# Altium schematic sheet HMC830_PLL.SchDoc: Sayma RTM
size 420 x 297 mm; $$Internal___BlkDate: 23:43:20_12-13-18; $$Internal_NAME_PLACEHOLDER: a2sheet_WUT; $$Internal_Resolution: 00001mm; $$NotCommonProperty_@NAME: Clock_Distribution_PLL; $$NotCommonProperty_@SHEET: 1; $$NotCommonProperty_@SHEETTOTAL: 16; CmpIndex: 103; Drawing Author: G.Kasprowicz; Drawing Number: Sayma RTM; Drawing Project: 8 channel SAWG; Drawing Revision: 2.0; SymIndex: 2228; Author: G.Kasprowicz; CompanyName: WUT ISE; DrawnBy: G.Kasprowicz; Organization: WUT ISE; Address1: PW ISE; Address2: Nowowiejska 15/19 00-665 Warsaw; Address3: gkasprow@gmail.com; DocumentNumber: 10; Revision: 1.0; SheetNumber: 10; SheetTotal: 15; ModifiedBy: -; CheckedDate: -; Title2: HMC830 & CLK distribution; DivGrp: WUT ISE; Designer: G.Kasprowicz; ModifiedDate: -; ProjectName: Sensor Box
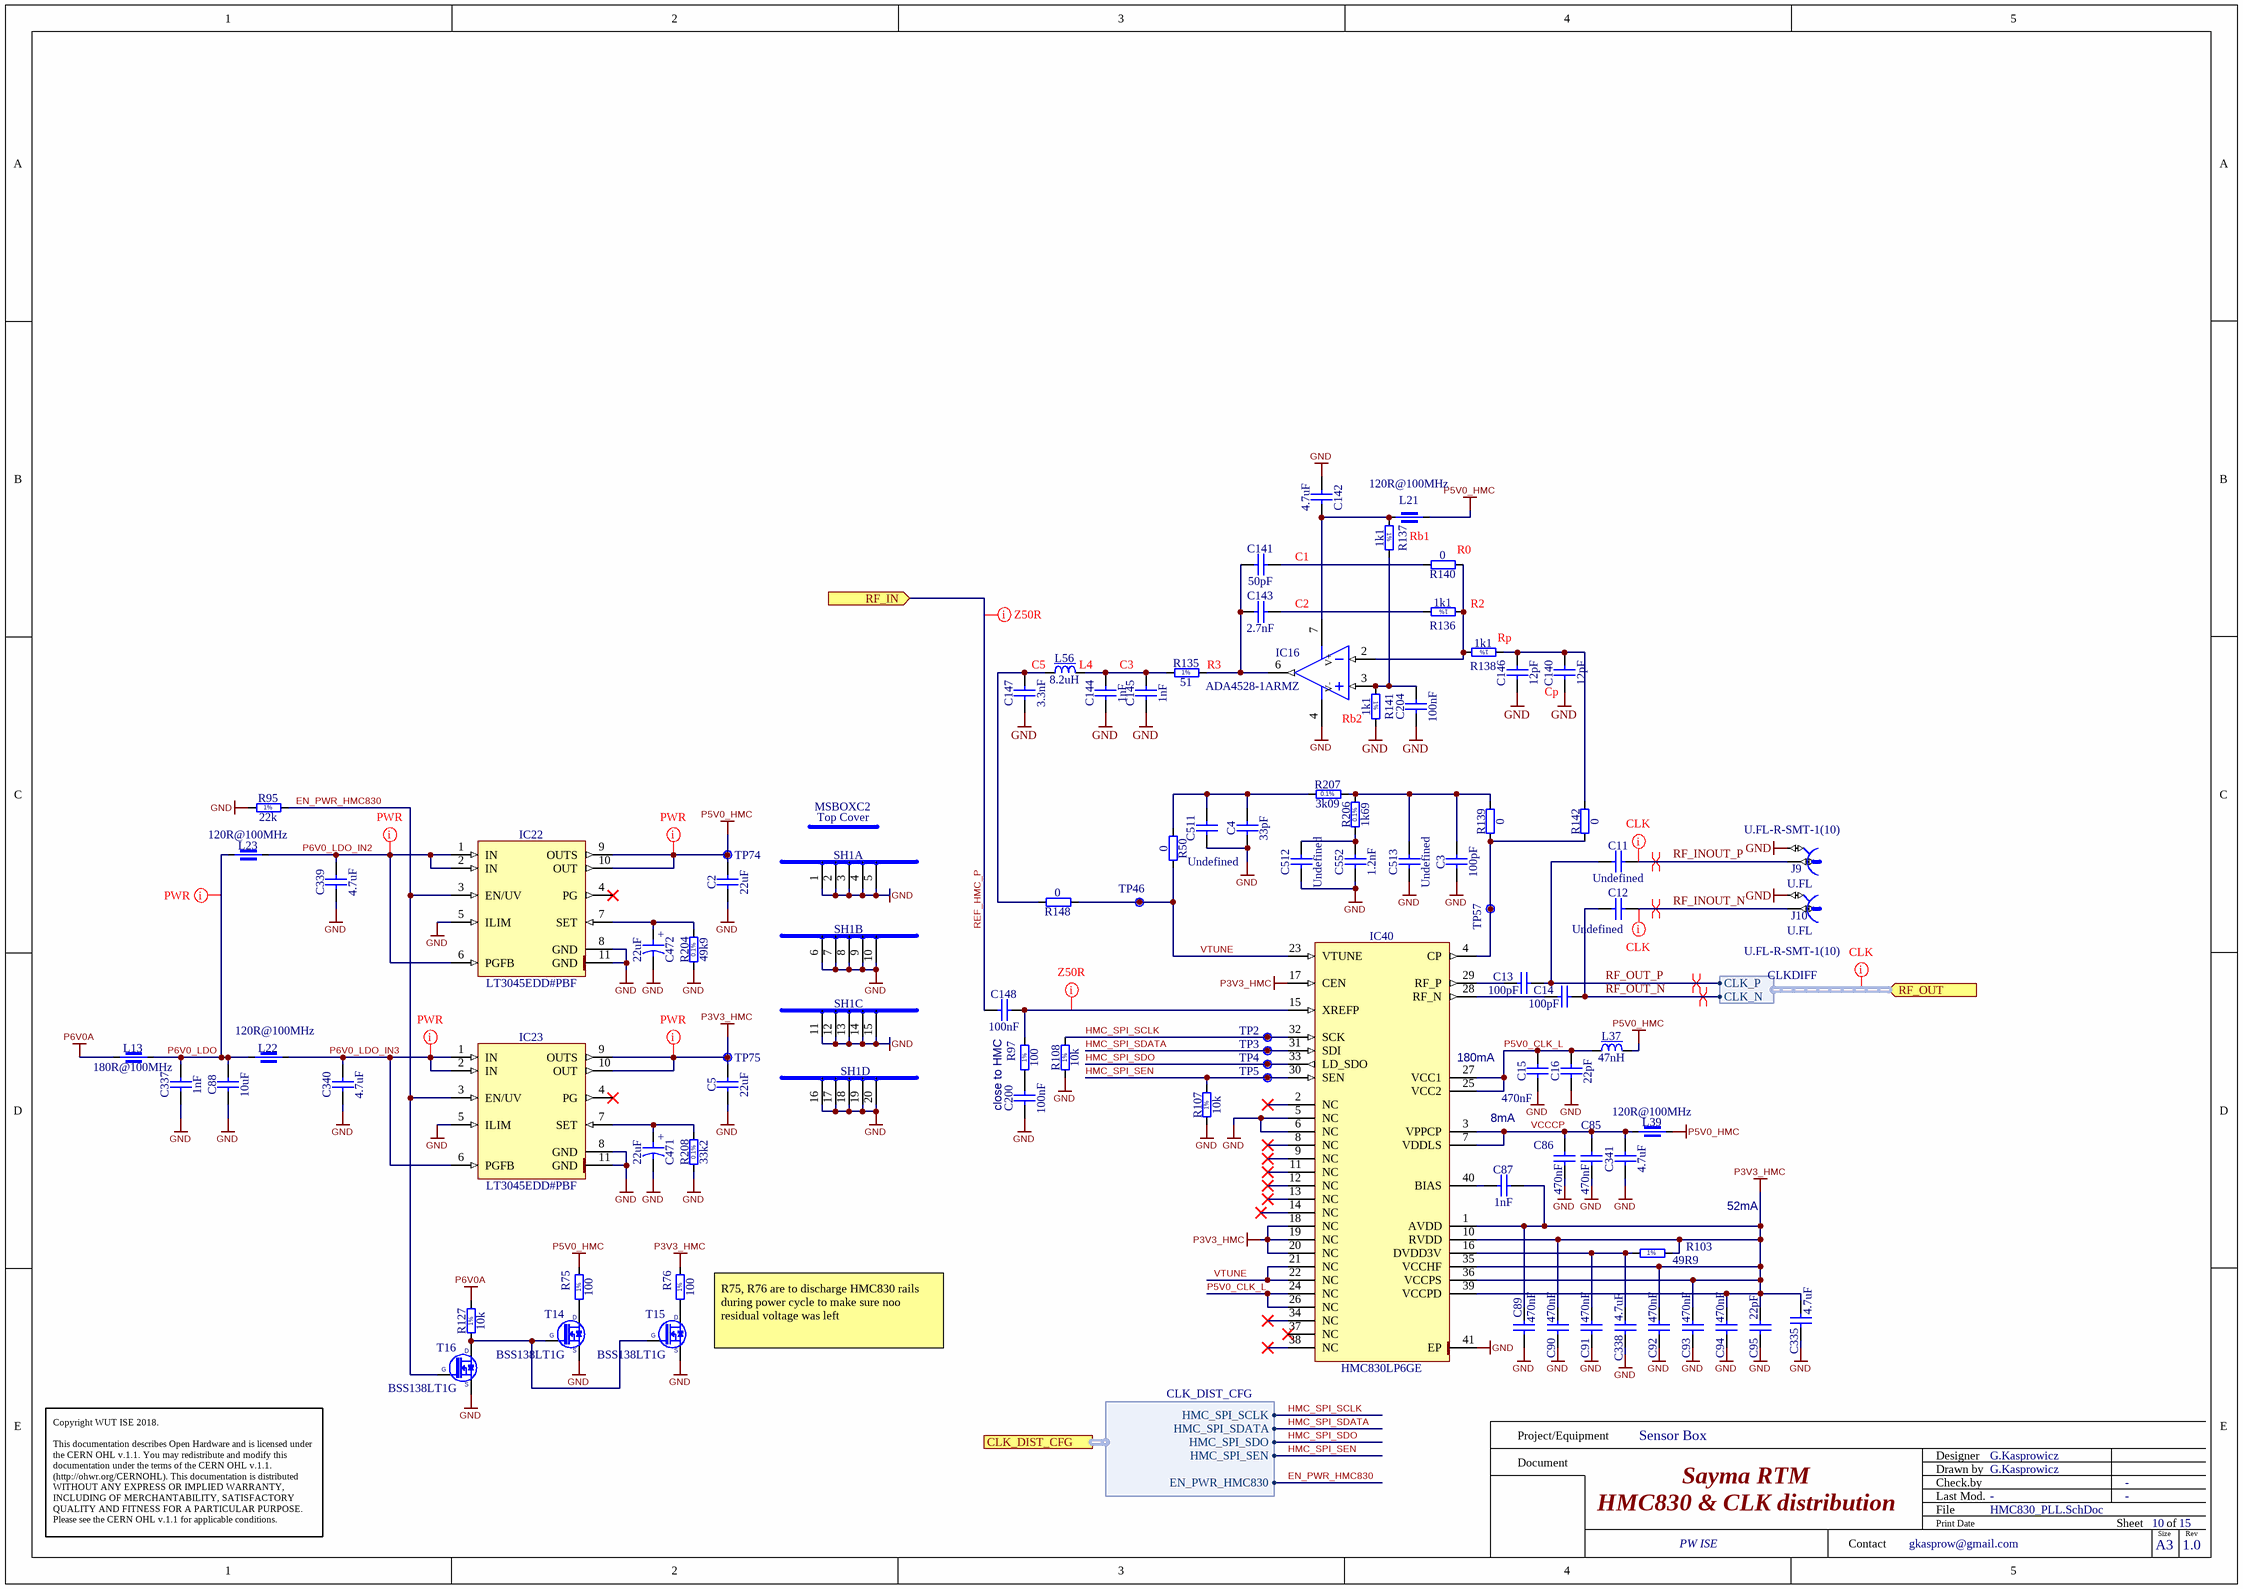
[diagram p0: HMC830_PLL.SchDoc]

## Parts
C2  22uF  [CAPC2012X135N]
C3  100pF  [CAPC1608X87N]
C4  33pF  [CAPC1608X87N]
C5  22uF  [CAPC2012X135N]
C11  Undefined  [CAPC1005X55N]
C12  Undefined  [CAPC1005X55N]
C13  100pF  [CAPC1608X87N]
C14  100pF  [CAPC1608X87N]
C15  470nF  [CAPC1005X55N]
C16  22pF  [CAPC1005X55N]
C85  470nF  [CAPC1005X55N]
C86  470nF  [CAPC1005X55N]
C87  1nF  [CAPC1005X55N]
C88  10uF  [CAPC3216X180N]
C89  470nF  [CAPC1005X55N]
C90  470nF  [CAPC1005X55N]
C91  470nF  [CAPC1005X55N]
C92  470nF  [CAPC1005X55N]
C93  470nF  [CAPC1005X55N]
C94  470nF  [CAPC1005X55N]
C95  22pF  [CAPC1005X55N]
C140  12pF  [CAPC1608X87N]
C141  50pF  [CAPC1608X90N]
C142  4.7uF  [CAPC1608X90N]
C143  2.7nF  [CAPC3216X140N]
C144  1nF  [CAPC1608X90N]
C145  1nF  [CAPC1608X90N]
C146  12pF  [CAPC1608X87N]
C147  3.3nF  [CAPC1608X87N]
C148  100nF  [CAPC0603X33N]
C200  100nF  [CAPC0603X33N]
C204  100nF  [CAPC0603X33N]
C335  4.7uF  [CAPC1608X90N]
C337  1nF  [CAPC1608X90N]
C338  4.7uF  [CAPC1608X90N]
C339  4.7uF  [CAPC1608X90N]
C340  4.7uF  [CAPC1608X90N]
C341  4.7uF  [CAPC1608X90N]
C471  22uF  [CAPMP3216X180N]
C472  22uF  [CAPMP3216X180N]
C511  Undefined  [CAPC2012X135N]
C512  Undefined  [CAPC2012X135N]
C513  Undefined  [CAPC2012X135N]
C552  1.2nF  [CAPC3216X140N]
IC16  ADA4528-1ARMZ  [SOP65P490X110-8N]
IC22  LT3045EDD#PBF  [SON50P300X300X80-11N-R175X248]
IC23  LT3045EDD#PBF  [SON50P300X300X80-11N-R175X248]
IC40  HMC830LP6GE  [QFN50P600X600X90-41N-S475]
J9  Manufacturer Part Number: U.FL-R-SMT-1(10)  [HIROSE_U.FL-R-SMT-1(10)]  (hidden comment: U.FL)
J10  Manufacturer Part Number: U.FL-R-SMT-1(10)  [HIROSE_U.FL-R-SMT-1(10)]  (hidden comment: U.FL)
L13  180R@100MHz  [INDC4516X180N]
L21  120R@100MHz  [INDC1608X95N]
L22  120R@100MHz  [INDC1608X95N]
L23  120R@100MHz  [INDC1608X95N]
L37  47nH  [INDC2014X145N]
L39  120R@100MHz  [INDC1608X95N]
L56  8.2uH  [IND_COILCRAFT_0603LS]
MSBOXC2  Top Cover  [MSBOX_WURTH_36003300]
R50  0  [RESC1608X55N]
R75  100  [RESC1005X40N]
R76  100  [RESC1005X40N]
R95  22k  [RESC1005X40N]
R97  100  [RESC1005X40N]
R103  49R9  [RESC1005X40N]
R107  10k  [RESC1005X40N]
R108  10k  [RESC1005X40N]
R127  10k  [RESC1005X40N]
R135  51  [RESC1608X55N]
R136  1k1  [RESC1608X55N]
R137  1k1  [RESC1608X55N]
R138  1k1  [RESC1608X55N]
R139  0  [RESC1608X55N]
R140  0  [RESC1608X55N]
R141  1k1  [RESC1608X55N]
R142  0  [RESC1608X55N]
R148  0  [RESC1608X55N]
R204  49k9  [RESC1608X55N]
R206  1k69  [RESC1608X55N]
R207  3k09  [RESC1608X55N]
R208  33k2  [RESC1608X55N]
SH1  Metal Screening Box 4x5 Pins  [MSBOX_WURTH_36103305]  (value not drawn)  (parts A,B,C,D of 4)
T14  BSS138LT1G  [SOT95P240X110-3N]
T15  BSS138LT1G  [SOT95P240X110-3N]
T16  BSS138LT1G  [SOT95P240X110-3N]
TP2  Test Point  [TPS127]  (value not drawn)
TP3  Test Point  [TPS127]  (value not drawn)
TP4  Test Point  [TPS127]  (value not drawn)
TP5  Test Point  [TPS127]  (value not drawn)
TP46  Test Point  [TPS127]  (value not drawn)
TP57  Test Point  [TPS127]  (value not drawn)
TP74  Test Point  [TPS127]  (value not drawn)
TP75  Test Point  [TPS127]  (value not drawn)

## Ports
CLK_DIST_CFG (harness CLK_DIST_CFG), RF_IN (in), RF_OUT (in, harness CLKDIFF)

## Harnesses
CLKDIFF: CLK_N, CLK_P
CLK_DIST_CFG: HMC_SPI_SCLK, HMC_SPI_SDATA, HMC_SPI_SDO, HMC_SPI_SEN, EN_PWR_HMC830

## Nets
GND: C2.1 C3.1 C4.1 C5.1 C15.1 C16.1 C85.1 C86.1 C88.1 C89.1 C90.1 C91.1 C92.1 C93.1 C94.1 C95.1 C140.1 C142.1 C144.1 C145.1 C146.1 C147.1 C200.1 C204.1 C335.1 C337.1 C338.1 C339.1 C340.1 C341.1 C471.2 C472.2 C511.1 C512.1 C513.1 C552.1 IC16.4(V-) IC22.5(ILIM) IC22.8(GND) IC22.11(GND) IC23.5(ILIM) IC23.8(GND) IC23.11(GND) IC40.5(NC) IC40.6(NC) IC40.41(EP) J9.2 J10.2 R95.1 R107.1 R108.1 R141.2 R204.1 R208.1 SH1.1 SH1.2 SH1.3 SH1.4 SH1.5 SH1.6 SH1.7 SH1.8 SH1.9 SH1.10 SH1.11 SH1.12 SH1.13 SH1.14 SH1.15 SH1.16 SH1.17 SH1.18 SH1.19 SH1.20 T14.2(S) T15.2(S) T16.2(S)
P3V3_HMC: C5.2 C87.2 C89.2 C90.2 C92.2 C93.2 C94.2 C95.2 C335.2 IC23.9(OUTS) IC23.10(OUT) IC40.1(AVDD) IC40.10(RVDD) IC40.17(CEN) IC40.18(NC) IC40.19(NC) IC40.20(NC) IC40.35(VCCHF) IC40.36(VCCPS) IC40.39(VCCPD) R76.2 R103.2 TP75.1
P5V0_HMC: C2.2 IC22.9(OUTS) IC22.10(OUT) L21.2 L37.2 L39.2 R75.2 TP74.1
P6V0A: L13.1 R127.2
EN_PWR_HMC830: IC22.3(EN/UV) IC23.3(EN/UV) R95.2 T16.1(G) ; port CLK_DIST_CFG.EN_PWR_HMC830
HMC_SPI_SCLK: IC40.32(SCK) R108.2 TP2.1 ; port CLK_DIST_CFG.HMC_SPI_SCLK
HMC_SPI_SDATA: IC40.31(SDI) TP3.1 ; port CLK_DIST_CFG.HMC_SPI_SDATA
HMC_SPI_SDO: IC40.33(LD_SDO) TP4.1 ; port CLK_DIST_CFG.HMC_SPI_SDO
HMC_SPI_SEN: IC40.30(SEN) R107.2 TP5.1 ; port CLK_DIST_CFG.HMC_SPI_SEN
P5V0_CLK_L: C15.2 C16.2 IC40.24(NC) IC40.25(VCC2) IC40.26(NC) IC40.27(VCC1) L37.1
P6V0_LDO: C88.2 C337.2 L13.2 L22.1 L23.1
P6V0_LDO_IN2: C339.2 IC22.1(IN) IC22.2(IN) IC22.6(PGFB) L23.2
P6V0_LDO_IN3: C340.2 IC23.1(IN) IC23.2(IN) IC23.6(PGFB) L22.2
REF_HMC_P: C148.1 ; port RF_IN
RF_INOUT_N: C12.2 J10.1
RF_INOUT_P: C11.2 J9.1
RF_OUT_N: C12.1 C14.1 ; port RF_OUT.CLK_N
RF_OUT_P: C11.1 C13.1 ; port RF_OUT.CLK_P
VCCCP: C85.2 C86.2 C341.2 IC40.3(VPPCP) IC40.7(VDDLS) L39.1
VTUNE: IC40.21(NC) IC40.22(NC) IC40.23(VTUNE) R50.2 R148.1 TP46.1
NetC3_2: C3.2 C513.2 R139.2 R206.2 R207.2
NetC4_2: C4.2 C511.2 R50.1 R207.1
NetC13_2: C13.2 IC40.29(RF_P)
NetC14_2: C14.2 IC40.28(RF_N)
NetC87_1: C87.1 IC40.40(BIAS)
NetC91_2: C91.2 C338.2 IC40.16(DVDD3V) R103.1
NetC140_2: C140.2 C146.2 R138.1 R142.2
NetC141_1: C141.1 C143.1 IC16.6(OUT) R135.2
NetC141_2: C141.2 R140.2
NetC142_2: C142.2 IC16.7(V+) L21.1 R137.1
NetC143_2: C143.2 R136.2
NetC144_2: C144.2 C145.2 L56.2 R135.1
NetC147_2: C147.2 L56.1 R148.2
NetC148_2: C148.2 IC40.15(XREFP) R97.2
NetC200_2: C200.2 R97.1
NetC204_2: C204.2 IC16.3(IN+) R137.2 R141.1
NetC471_1: C471.1 IC23.7(SET) R208.2
NetC472_1: C472.1 IC22.7(SET) R204.2
NetC512_2: C512.2 C552.2 R206.1
NetIC16_2: IC16.2(IN-) R136.1 R138.2 R140.1
NetIC40_4: IC40.4(CP) R139.1 R142.1 TP57.1
NetR75_1: R75.1 T14.3(D)
NetR76_1: R76.1 T15.3(D)
NetR127_1: R127.1 T14.1(G) T15.1(G) T16.3(D)

Not connected (* = marked no-connect by the designer): IC22 4(PG)*; IC23 4(PG)*; IC40 2(NC)* 8(NC)* 9(NC)* 11(NC)* 12(NC)* 13(NC)* 14(NC)* 34(NC)* 37(NC)* 38(NC)*

## Layout directives
net class Z50R: NetC148_2, REF_HMC_P
differential pair: RF_INOUT_N, RF_INOUT_P, RF_OUT_N, RF_OUT_P
net class CLK: (no net found under the mark), RF_INOUT_N, RF_INOUT_P
net class PWR: P3V3_HMC, P5V0_HMC, P6V0_LDO, P6V0_LDO_IN2, P6V0_LDO_IN3

## Notes on the sheet
- (near C141) C1
- Rb1
- (near R140) R0
- C5
- (near L56) L4
- C3
- (near R135) R3
- C2
- (near R136) R2
- (near R138) Rp
- Rb2
- (near C140) Cp
- (near IC40) 180mA
- close to HMC
- 8mA
- 52mA
- R75, R76 are to discharge HMC830 rails during power cycle to make sure noo residual voltage was left
- Project/Equipment
- Document
- Designer
- Drawn by
- Check.by
- Copyright WUT ISE 2018.
  This documentation describes Open Hardware and is licensed under the CERN OHL v.1.1. You may redistribute and modify this documentation under the terms of the CERN OHL v.1.1. (http://ohwr.org/CERNOHL). This documentation is distributed WITHOUT ANY EXPRESS OR IMPLIED WARRANTY, INCLUDING OF MERCHANTABILITY, SATISFACTORY QUALITY AND FITNESS FOR A PARTICULAR PURPOSE. Please see the CERN OHL v.1.1 for applicable conditions.
- Contact
- File
- Last Mod.
- Print Date
- Sheet
- Size
- A3
- of
- Rev
- (in symbol CTE3216-18_22UF_6.3V_10%_LESR0900) +
- (in symbol R0402_10K_1%_0.0625W_100PPM) 1%
- (in symbol R0402_22K_1%_0.0625W_100PPM) 1%
- (in symbol R0402_49R9_1%_0.0625W_100PPM) 1%
- (in symbol R0402_100R_1%_0.0625W_100PPM) 1%
- (in symbol R0603_1K1_1%_0.1W_100PPM) 1%
- (in symbol R0603_1K69_0.1%_0.063W_10PPM) 0.1%
- (in symbol R0603_3K09_0.1%_0.063W_10PPM) 0.1%
- (in symbol R0603_33K2_0.1%_0.063W_10PPM) 0.1%
- (in symbol R0603_49K9_0.1%_0.063W_10PPM) 0.1%
- (in symbol R0603_51R_1%_0.1W_100PPM) 1%

## Library data of the parts
C2 C5 = CC0805_22UF_16V_10%_X5R: Non-polarised capacitor; Manufacturer: GENERIC; Manufacturer1 Part Number: C2012X5R1C226KT; Part Description: SMD Multilayer Chip Ceramic Capacitor; TC: X5R; Tolerance: ±10%; Voltage: 16V; Case: 0805; Manufacturer Part Number: CC0805_22UF_16V_10%_X5R; Manufacturer1 Example: TDK; Part Number: CC0805_22UF_16V_10%_X5R; Pin Count: 2; SMD: Yes; Status: Preferred; Value: 22uF; Component Kind: Standard; Component Type: Standard; Mounted: Yes; Socket: No; Sense: No; Manufacturer1 ComponentHeight: 1.35mm; HelpURL: \\cern.ch\dfs\Applications\Altium\Datasheets\CC0805_X5R_TDK_C.pdf; Author: CERN DEM JLC; CreateDate: 25.10.2012; LatestRevisionDate: 25.10.2012
C3 C13 C14 = CC0603_100PF_50V_5%_NP0: Non-polarised capacitor; Manufacturer: GENERIC; Manufacturer1 Part Number: 223886715101; Part Description: SMD Multilayer Chip Ceramic Capacitor; TC: C0G/NP0; Tolerance: ±5%; Voltage: 50V; Case: 0603; Manufacturer Part Number: CC0603_100PF_50V_5%_NP0; Manufacturer1 Example: PHYCOMP; Part Number: CC0603_100PF_50V_5%_NP0; Pin Count: 2; SMD: Yes; Status: Preferred; Value: 100pF; Component Kind: Standard; Component Type: Standard; Mounted: Yes; Socket: No; Sense: No; Manufacturer1 ComponentHeight: 0.87mm; HelpURL: \\cern.ch\dfs\Applications\Altium\Datasheets\CC0603_NP0_PHYCOMP.pdf; Author: CERN DEM JLC; CreateDate: 03.12.2007; LatestRevisionDate: 03.12.2007
C4 = CC0603_33PF_50V_5%_NP0: Non-polarised capacitor; Manufacturer: GENERIC; Manufacturer1 Part Number: 223886715339; Part Description: SMD Multilayer Chip Ceramic Capacitor; TC: C0G/NP0; Tolerance: ±5%; Voltage: 50V; Case: 0603; Manufacturer Part Number: CC0603_33PF_50V_5%_NP0; Manufacturer1 Example: PHYCOMP; Part Number: CC0603_33PF_50V_5%_NP0; Pin Count: 2; SMD: Yes; Status: Preferred; Value: 33pF; Component Kind: Standard; Component Type: Standard; Mounted: Yes; Socket: No; Sense: No; Manufacturer1 ComponentHeight: 0.87mm; HelpURL: \\cern.ch\dfs\Applications\Altium\Datasheets\CC0603_NP0_PHYCOMP.pdf; Author: CERN DEM JLC; CreateDate: 03.12.2007; LatestRevisionDate: 03.12.2007
C11 C12 = CC0402_NO-VALUE: Non-polarised capacitor; Part Description: Reserved Footprint For 0402(1005) Chip Ceramic Capacitor; Mounted: No; Part Number: CC0402_NO-VALUE; Component Kind: Standard; Component Type: Standard; Pin Count: 2; Value: Undefined; Status: None; Manufacturer: Undefined; Manufacturer Part Number: CC0402_NO-VALUE; Case: 0402; Socket: No; SMD: Yes; Sense: No; Manufacturer1 ComponentHeight: 0.55mm; HelpURL: Undefined; Author: CERN DEM JLC; CreateDate: 14.01.2014; LatestRevisionDate: 14.01.2014
C15 C85 C86 C89-C94 = CC0402_470NF_16V_10%_X5R: Non-polarised capacitor; Manufacturer: GENERIC; Manufacturer1 Part Number: C1005X5R1C105KT; Part Description: SMD Multilayer Chip Ceramic Capacitor; TC: X5R; Tolerance: ±10%; Voltage: 16V; Case: 0402; Manufacturer Part Number: CC0402_470NF_16V_10%_X5R; Manufacturer1 Example: TDK; Part Number: CC0402_470NF_16V_10%_X5R; Pin Count: 2; SMD: Yes; Status: Preferred; Value: 470nF; Component Kind: Standard; Component Type: Standard; Mounted: Yes; Socket: No; Sense: No; Manufacturer1 ComponentHeight: 0.55mm; HelpURL: \\cern.ch\dfs\Applications\Altium\Datasheets\CC0402_X5R_TDK_C.pdf; Author: CERN DEM JLC; CreateDate: 25.10.2012; LatestRevisionDate: 25.10.2012
C16 C95 = CC0402_22PF_50V_5%_C0G: Non-polarised capacitor; Manufacturer: GENERIC; Manufacturer1 Part Number: C0402C220J5GACTU; Part Description: SMD Multilayer Chip Ceramic Capacitor; TC: C0G/NP0; Tolerance: ±5%; Voltage: 50V; Case: 0402; Manufacturer Part Number: CC0402_22PF_50V_5%_C0G; Manufacturer1 Example: KEMET; Part Number: CC0402_22PF_50V_5%_C0G; Pin Count: 2; SMD: Yes; Status: Preferred; Value: 22pF; Component Kind: Standard; Component Type: Standard; Mounted: Yes; Socket: No; Sense: No; Manufacturer1 ComponentHeight: 0.55mm; HelpURL: \\cern.ch\dfs\Applications\Altium\Datasheets\CC0805_C0G_KEMET_(Commercial Grade).pdf; Author: CERN DEM JLC; CreateDate: 03.12.2007; LatestRevisionDate: 03.12.2007
C87 = CC0402_1NF_50V_10%_X7R: Non-polarised capacitor; Manufacturer: GENERIC; Manufacturer1 Part Number: 223858715623; Part Description: SMD Multilayer Chip Ceramic Capacitor; TC: X7R; Tolerance: ±10%; Voltage: 50V; Case: 0402; Manufacturer Part Number: CC0402_1NF_50V_10%_X7R; Manufacturer1 Example: PHYCOMP; Part Number: CC0402_1NF_50V_10%_X7R; Pin Count: 2; SMD: Yes; Status: Not Recommended; Value: 1nF; Component Kind: Standard; Component Type: Standard; Mounted: Yes; Socket: No; Sense: No; Manufacturer1 ComponentHeight: 0.55mm; HelpURL: \\cern.ch\dfs\Applications\Altium\Datasheets\CC0402_X7R_PHYCOMP.pdf; Author: CERN DEM JLC; CreateDate: 03.12.2007; LatestRevisionDate: 03.12.2007
C88 = CC1206_10uF_25V_10%_X7R: Non-polarised capacitor; Manufacturer: GENERIC; Manufacturer1 Part Number: C1206C106K4RACTU; Part Description: SMD Multilayer Chip Ceramic Capacitor; TC: X7R; Tolerance: ±10%; Voltage: 25V; Case: 1206; Manufacturer Part Number: CC1206_10uF_25V_10%_X7R; Manufacturer1 Example: KEMET; Part Number: CC1206_10UF_25V_10%_X7R; Pin Count: 2; SMD: Yes; Status: Preferred; Value: 10uF; Component Kind: Standard; Component Type: Standard; Mounted: Yes; Socket: No; Sense: No; Manufacturer1 ComponentHeight: 1.8mm; HelpURL: \\cern.ch\dfs\Applications\Altium\Datasheets\CC1206_X7R_KEMET.pdf; Author: CERN DEM JLC; CreateDate: 12.09.2012; LatestRevisionDate: 12.09.2012
C140 C146 = CC0603_12PF_50V_5%_NP0: Non-polarised capacitor; Part Description: SMD Multilayer Chip Ceramic Capacitor; Manufacturer: GENERIC; Manufacturer1 Part Number: 223886715129; Voltage: 50V; TC: C0G/NP0; Tolerance: ±5%; Part Number: CC0603_12PF_50V_5%_NP0; Component Kind: Standard; Component Type: Standard; Pin Count: 2; Value: 12pF; Status: Preferred; Manufacturer Part Number: CC0603_12PF_50V_5%_NP0; Case: 0603; Mounted: Yes; Socket: No; SMD: Yes; Sense: No; Manufacturer1 Example: PHYCOMP; Manufacturer1 ComponentHeight: 0.87mm; HelpURL: \\cern.ch\dfs\Applications\Altium\Datasheets\CC0603_NP0_PHYCOMP.pdf; Author: CERN DEM JLC; CreateDate: 03.12.2007; LatestRevisionDate: 03.12.2007
C141 = CC0603_50PF_50V_5%_NP0: Non-polarised capacitor; Part Description: SMD Multilayer Chip Ceramic Capacitor; Manufacturer: GENERIC; Manufacturer1 Part Number: 06035A500JAT2A; Voltage: 50V; TC: C0G/NP0; Tolerance: ±5%; Part Number: CC0603_50PF_50V_5%_NP0; Component Kind: Standard; Component Type: Standard; Pin Count: 2; Value: 50pF; Status: Preferred; Manufacturer Part Number: CC0603_50PF_50V_5%_NP0; Case: 0603; Mounted: Yes; Socket: No; SMD: Yes; Sense: No; Manufacturer1 Example: AVX; Manufacturer1 ComponentHeight: 0.9mm; HelpURL: \\cern.ch\dfs\Applications\Altium\Datasheets\CC0603_NP0_AVX.pdf; Author: CERN DEM JLC; CreateDate: 15.01.2018; LatestRevisionDate: 15.01.2018
C142 C335 C338-C341 = CC0603_4.7UF_25V_10%_X5R: Non-polarised capacitor; Manufacturer: GENERIC; Manufacturer1 Part Number: GRM188R61E475KE11D; Part Description: SMD Multilayer Chip Ceramic Capacitor; Tolerance: ±10%; Voltage: 25V; TC: X5R; Case: 0603; Manufacturer Part Number: CC0603_4.7UF_25V_10%_X5R; Manufacturer1 Example: MURATA; Part Number: CC0603_4.7UF_25V_10%_X5R; Pin Count: 2; SMD: Yes; Value: 4.7uF; Component Kind: Standard; Component Type: Standard; Status: None; Mounted: Yes; Socket: No; Sense: No; Manufacturer1 ComponentHeight: 0.95mm; HelpURL: \\cern.ch\dfs\Applications\Altium\Datasheets\CC0603_MURATA_GRM188R61E475KE11D.pdf; Author: CERN DEM JLC; CreateDate: 10.11.2014; LatestRevisionDate: 10.11.2014
C143 = CC1206_2.7NF_100V_1%_NP0: Non-polarised capacitor; Part Description: SMD Multilayer Chip Ceramic Capacitor; Manufacturer: GENERIC; Manufacturer1 Part Number: VJ1206A272FXBMT; Voltage: 100V; TC: C0G/NP0; Tolerance: ±1%; Part Number: CC1206_2.7NF_100V_1%_NP0; Component Kind: Standard; Component Type: Standard; Pin Count: 2; Value: 2.7nF; Status: None; Manufacturer Part Number: CC1206_2.7NF_100V_1%_NP0; Case: 1206; Mounted: Yes; Socket: No; SMD: Yes; Sense: No; Manufacturer1 Example: VISHAY VITRAMON; Manufacturer1 ComponentHeight: 1.7mm; HelpURL: \\cern.ch\dfs\Applications\Altium\Datasheets\CC1206_NP0_VISHAY_VJ.pdf; Author: CERN DEM JLC; CreateDate: 19.11.2012; LatestRevisionDate: 19.11.2012
C144 C145 = CC0603_1NF_50V_1%_NP0: Non-polarised capacitor; Part Description: SMD Multilayer Chip Ceramic Capacitor; Manufacturer: GENERIC; Manufacturer1 Part Number: 06035A102FAT2A; Voltage: 50V; TC: C0G/NP0; Tolerance: ±1%; Part Number: CC0603_1NF_50V_1%_NP0; Component Kind: Standard; Component Type: Standard; Pin Count: 2; Value: 1nF; Status: None; Manufacturer Part Number: CC0603_1NF_50V_1%_NP0; Case: 0603; Mounted: Yes; Socket: No; SMD: Yes; Sense: No; Manufacturer1 Example: AVX; Manufacturer1 ComponentHeight: 0.9mm; HelpURL: \\cern.ch\dfs\Applications\Altium\Datasheets\CC0603_C0G_AVX.pdf; Author: CERN DEM JLC; CreateDate: 15.06.2017; LatestRevisionDate: 15.06.2017
C147 = CC0603_3.3NF_50V_10%_X7R: Non-polarised capacitor; Part Description: SMD Multilayer Chip Ceramic Capacitor; Manufacturer: GENERIC; Manufacturer1 Part Number: 223858615629; Voltage: 50V; TC: X7R; Tolerance: ±10%; Part Number: CC0603_3.3NF_50V_10%_X7R; Component Kind: Standard; Component Type: Standard; Pin Count: 2; Value: 3.3nF; Status: Preferred; Manufacturer Part Number: CC0603_3.3NF_50V_10%_X7R; Case: 0603; Mounted: Yes; Socket: No; SMD: Yes; Sense: No; Manufacturer1 Example: PHYCOMP; Manufacturer1 ComponentHeight: 0.87mm; HelpURL: \\cern.ch\dfs\Applications\Altium\Datasheets\CC0603_X7R_PHYCOMP.pdf; Author: CERN DEM JLC; CreateDate: 03.12.2007; LatestRevisionDate: 03.12.2007
C148 C200 C204 = CC0201_100NF_6.3V_10%_X5R: Non-polarised capacitor; Manufacturer: GENERIC; Manufacturer1 Part Number: 02016D104KAT2A; Part Description: SMD Multilayer Chip Ceramic Capacitor; TC: X5R; Tolerance: ±10%; Voltage: 6.3V; Case: 0201; Manufacturer Part Number: CC0201_100NF_6.3V_10%_X5R; Manufacturer1 Example: AVX; Part Number: CC0201_100NF_6.3V_10%_X5R; Pin Count: 2; SMD: Yes; Status: Not Recommended; Value: 100nF; Component Kind: Standard; Component Type: Standard; Mounted: Yes; Socket: No; Sense: No; Manufacturer1 ComponentHeight: 0.33mm; HelpURL: \\cern.ch\dfs\Applications\Altium\Datasheets\CC0201_X5R_AVX.pdf; Author: CERN DEM JLC; CreateDate: 03.12.2007; LatestRevisionDate: 03.12.2007
C337 = CC0603_1NF_50V_5%_NP0: Non-polarised capacitor; Manufacturer: GENERIC; Manufacturer1 Part Number: CC0603JRNPO9BN102; Part Description: SMD Multilayer Chip Ceramic Capacitor; TC: C0G/NP0; Tolerance: ±5%; Voltage: 50V; Case: 0603; Manufacturer Part Number: CC0603_1NF_50V_5%_NP0; Manufacturer1 Example: YAGEO PHYCOMP; Part Number: CC0603_1NF_50V_5%_NP0; Pin Count: 2; SMD: Yes; Status: Preferred; Value: 1nF; Component Kind: Standard; Component Type: Standard; Mounted: Yes; Socket: No; Sense: No; Manufacturer1 ComponentHeight: 0.9mm; HelpURL: \\cern.ch\dfs\Applications\Altium\Datasheets\CC0805_NP0_PHYCOMP_16VTO50V.pdf; Author: CERN DEM JLC; CreateDate: 22.10.2012; LatestRevisionDate: 22.10.2012
C471 C472 = CTE3216-18_22UF_6.3V_10%_LESR0900: Polarised capacitor; Manufacturer: GENERIC; Manufacturer1 Part Number: TPSA226K006R0900; Part Description: Low ESR 0R9 Solid Tantalum Chip Capacitor; Tolerance: ±10%; Voltage: 6.3V; Case: A; Manufacturer Part Number: CTE3216-18_22UF_6.3V_10%_LESR0900; Manufacturer1 Example: AVX; Part Number: CTE3216-18_22UF_6.3V_10%_LESR0900; Pin Count: 2; SMD: Yes; Status: Preferred; Value: 22uF; Component Kind: Standard; Component Type: Standard; Mounted: Yes; Socket: No; Sense: No; Manufacturer1 ComponentHeight: 1.8mm; HelpURL: \\cern.ch\dfs\Applications\Altium\Datasheets\CTE-LESR_AVX_TPS.pdf; Author: CERN DEM JLC; CreateDate: 05.05.2008; LatestRevisionDate: 20.01.2009
C511-C513 = CC0805_NO-VALUE: Non-polarised capacitor; Part Description: Reserved Footprint For 0805(2012) Chip Ceramic Capacitor; Mounted: No; Case: 0805; Manufacturer Part Number: CC0805_NO-VALUE; Manufacturer: Undefined; Part Number: CC0805_NO-VALUE; Pin Count: 2; SMD: Yes; Status: None; Value: Undefined; Component Kind: Standard; Component Type: Standard; Socket: No; Sense: No; Manufacturer1 ComponentHeight: 1.35mm; HelpURL: Undefined; Author: CERN DEM JLC; CreateDate: 10.12.2008; LatestRevisionDate: 11.09.2013
C552 = CC1206_1.2NF_50V_5%_NP0: Non-polarised capacitor; Manufacturer: GENERIC; Manufacturer1 Part Number: 2238 863 15122; Part Description: SMD Multilayer Chip Ceramic Capacitor; TC: C0G/NP0; Tolerance: ±5%; Voltage: 50V; Case: 1206; Manufacturer Part Number: CC1206_1.2NF_50V_5%_NP0; Manufacturer1 Example: PHYCOMP; Part Number: CC1206_1.2NF_50V_5%_NP0; Pin Count: 2; SMD: Yes; Status: Preferred; Value: 1.2nF; Component Kind: Standard; Component Type: Standard; Mounted: Yes; Socket: No; Sense: No; Manufacturer1 ComponentHeight: 1.25mm; HelpURL: \\cern.ch\dfs\Applications\Altium\Datasheets\CC1206_NP0_PHYCOMP.pdf; Author: CERN DEM JLC; CreateDate: 03.12.2007; LatestRevisionDate: 03.12.2007
IC16 = ADA4528-1ARMZ: Operational Amplifier; Part Description: Precision, Ultralow Noise, RRIO, Zero-Drift Operational Amplifier; Manufacturer: ANALOG DEVICES; PressFit: No; Bonding: No; Part Number: ADA4528-1ARMZ; Component Kind: Standard; Component Type: Standard; Device: ADA4528-1ARMZ; PackageDescription: SOP, 0.65mm pitch; 8 pin, 3.00mm W X 3.00mm L X 1.10mm H body, IPC Medium Density; Manufacturer Part Number: ADA4528-1ARMZ; Pin Count: 8; Case: MSOP8; Mounted: Yes; Socket: No; SMD: Yes; Sense: No; ComponentHeight: 1.1mm; Author: CERN DEM JLC; HelpURL: \\cern.ch\dfs\Applications\Altium\Datasheets\ADA4528-1ARMZ.pdf; CreateDate: 16.01.2012; LatestRevisionDate: 16.01.2012
IC22 IC23 = LT3045EDD#PBF: 20V, 500mA, Ultralow Noise, Ultrahigh PSRR Linear Regulator; Manufacturer: LINEAR TECHNOLOGY; PressFit: No; Bonding: No; Case: SON10; ComponentHeight: 0.8mm; Device: LT3045EDD#PBF; Manufacturer Part Number: LT3045EDD#PBF; PackageDescription: SON, 0.50mm Pitch, 10-pin, 3.00mm W  X 3.00mm L X 0.80mm Height, (w/thermal tab 1.75 X 2.48 mm), IPC Medium Density; Part Description: 20V, 500mA, Ultralow Noise, Ultrahigh PSRR Linear Regulator; Part Number: LT3045EDD#PBF; Pin Count: 11; SMD: Yes; Component Kind: Standard; Component Type: Standard; Mounted: Yes; Socket: No; Sense: No; HelpURL: \\cern.ch\dfs\Applications\Altium\Datasheets\LT3045EDD#PBF.pdf; Author: CERN DEM JLC; CreateDate: 07.12.2016; LatestRevisionDate: 07.12.2016
IC40 = HMC830LP6GE: Fractional-N PLL With Integrated VCO, 25 to 3000MHz; Manufacturer: HITTITE MICROWAVE CORP; Bonding: No; PressFit: No; Author: CERN DEM JMW; Case: QFN40; Component Kind: Standard; Component Type: Standard; ComponentHeight: 0.9mm; CreateDate: 17.08.2016; Device: HMC830LP6GE; HelpURL: \\cern.ch\dfs\Applications\Altium\Datasheets\HMC830LP6GE.pdf; LatestRevisionDate: 17.08.2016; Manufacturer Part Number: HMC830LP6GE; Mounted: Yes; PackageDescription: QFN, 0.50mm Pitch, Square; 40 Pin, 4.00mm L X 4.00mm W X 1.00mm H Body (w/thermal Tab 2.95 X 2.95mm), IPC Medium Density; Part Description: Fractional-N PLL With Integrated VCO, 25 to 3000MHz; Part Number: HMC830LP6GE; Pin Count: 41; Sense: No; SMD: Yes; Socket: No
J9 J10 = HIROSE_U.FL-R-SMT-1(10): Manufacturer: HIROSE (HRS); Part Description: Up to 6GHz Ultra Small Surface Mount Male Coaxial Connectors U.FL Series; PressFit: No; ComponentHeight: 1.25mm; Family: U.FL; Part Number: HIROSE_U.FL-R-SMT-1(10); Pin Count: 2; SMD: Yes; Status: None; Component Kind: Standard; Component Type: Standard; Mounted: Yes; Socket: No; Sense: No; HelpURL: \\cern.ch\dfs\Applications\Altium\Datasheets\HIROSE_U.FL-R-SMT-1(10).pdf; Author: CERN DEM JLC; CreateDate: 24.03.2010; LatestRevisionDate: 24.03.2010
L13 = IND1806_MURATA_BLM41PG181SN1L: Manufacturer: MURATA; Part Description: SMD EMI Suppression Chip Ferrite Bead (BLM41P Series); Power: 3.5A; Resistance: 0.02R; Case: 1806; ComponentHeight: 1.8mm; Manufacturer Part Number: BLM41PG181SN1L; Part Number: IND1806_MURATA_BLM41PG181SN1L; Pin Count: 2; SMD: Yes; Value: 180R@100MHz; Component Kind: Standard; Component Type: Standard; Status: None; Mounted: Yes; Socket: No; Sense: No; HelpURL: \\cern.ch\dfs\Applications\Altium\Datasheets\IND1806_MURATA_BLM41P.pdf; Author: CERN DEM JLC; CreateDate: 26.06.2012; LatestRevisionDate: 26.06.2012
L21-L23 L39 = IND0603_MURATA_BLM18PG121SN1D: Manufacturer: MURATA; Part Description: SMD EMIFIL Chip Ferrite Bead; Power: 2A; Resistance: 0.05R; Case: 0603; ComponentHeight: 0.95mm; Manufacturer Part Number: BLM18PG121SN1D; Part Number: IND0603_MURATA_BLM18PG121SN1D; Pin Count: 2; SMD: Yes; Value: 120R@100MHz; Component Kind: Standard; Component Type: Standard; Status: None; Mounted: Yes; Socket: No; Sense: No; HelpURL: \\cern.ch\dfs\Applications\Altium\Datasheets\IND0603_MURATA_BLM18P.pdf; Author: CERN DEM BC; CreateDate: 27.07.2015; LatestRevisionDate: 25.10.2018
L37 = IND0805_47NH_5%_EPCOS_B82498B: Inductor With Core; Manufacturer Part Number: B82498B3470J; Manufacturer: EPCOS; Part Description: SMT Inductor SIMID Series; Power: 500mA; Resistance: 0.13R; Tolerance: ±5%; Case: 0805; ComponentHeight: 1.45mm; Part Number: IND0805_47NH_5%_EPCOS_B82498B; Pin Count: 2; SMD: Yes; Value: 47nH; Component Kind: Standard; Component Type: Standard; Status: Preferred; Mounted: Yes; Socket: No; Sense: No; HelpURL: \\cern.ch\dfs\Applications\Altium\Datasheets\IND0805_EPCOS_B82498B.pdf; Author: CERN DEM JLC; CreateDate: 11.02.2008; LatestRevisionDate: 26.06.2008
L56 = L_0603_8.2uH: Inductor With Core; Part Number: IND_8.2UH_2%_COILCRAFT_0603LS; Part Description: SMT Chip Inductor; Manufacturer: COILCRAFT; Manufacturer Part Number: 0603LS-822XGLB; Power: 190mA; Resistance: 3.6R; Tolerance: ±2%; Component Kind: Standard; Component Type: Standard; Pin Count: 2; Value: 8.2uH; Status: None; Case: 0603; Mounted: Yes; Socket: No; SMD: Yes; Sense: No; ComponentHeight: 1.12mm; HelpURL: \\cern.ch\dfs\Applications\Altium\Datasheets\IND_COILCRAFT_0603LS.pdf; Author: GK; CreateDate: 15.06.2015; LatestRevisionDate: 15.06.2015
MSBOXC2 = MSBOX_WURTH_36003300: Metal Screening Box - Top Cover 0 Pin; Part Description: Top Cover For 30 x 30mm WE-SHC Shielding Cabinet; Manufacturer: WURTH; PressFit: No; Part Number: MSBOX_WURTH_36003300; Component Kind: Standard; Component Type: Standard; Pin Count: 0; PackageDescription: Top Cover For 30 x 30mm WE-SHC Shielding Cabinet; Mounted: Yes; Socket: No; SMD: No; Sense: No; Status: None; Manufacturer Part Number: 36003300; ComponentHeight: 3.1mm; HelpURL: \\cern.ch\dfs\Applications\Altium\Datasheets\MSBOX_WURTH_36003300.pdf; Author: CERN DEM JLC; CreateDate: 02.07.2012; LatestRevisionDate: 02.07.2012
R50 R139 R140 R142 R148 = R0603_0R_JUMPER: Resistor; Part Description: 1A (0.05R Max DC Resistance) Zero Ohm Jumper; Manufacturer: GENERIC; Manufacturer1 Part Number: NRC06Z0; PressFit: No; Part Number: R0603_0R_JUMPER; Component Kind: Standard; Component Type: Standard; Pin Count: 2; Value: 0; Status: Preferred; Manufacturer Part Number: R0603_0R_JUMPER; Case: 0603; Mounted: Yes; Sense: No; Socket: No; SMD: Yes; Manufacturer1 Example: NIC COMPONENT; Manufacturer1 ComponentHeight: 0.55mm; HelpURL: \\cern.ch\dfs\Applications\Altium\Datasheets\R0603_NIC_NRC.pdf; Author: CERN DEM JLC; CreateDate: 03.12.2007; LatestRevisionDate: 13.03.2008
R75 R76 R97 = R0402_100R_1%_0.0625W_100PPM: Resistor - 1%; Manufacturer: GENERIC; Manufacturer1 Part Number: 232270671001L; Part Description: General Purpose Thick Film Chip Resistor; TC: ±100ppm/°C; PressFit: No; Case: 0402; Manufacturer Part Number: R0402_100R_1%_0.0625W_100PPM; Manufacturer1 ComponentHeight: 0.4mm; Manufacturer1 Example: YAGEO PHYCOMP; Part Number: R0402_100R_1%_0.0625W_100PPM; Pin Count: 2; Power: 0.0625W; Sense: No; SMD: Yes; Status: Not Recommended; Tolerance: ±1%; Value: 100; Component Kind: Standard; Component Type: Standard; Mounted: Yes; Socket: No; HelpURL: \\cern.ch\dfs\Applications\Altium\Datasheets\R0402_Phycomp_RC0402.pdf; Author: CERN DEM JLC; CreateDate: 03.12.2007; LatestRevisionDate: 17.10.2012
R95 = R0402_22K_1%_0.0625W_100PPM: Resistor - 1%; Manufacturer: GENERIC; Manufacturer1 Part Number: 232270672203L; Part Description: General Purpose Thick Film Chip Resistor; TC: ±100ppm/°C; PressFit: No; Case: 0402; Manufacturer Part Number: R0402_22K_1%_0.0625W_100PPM; Manufacturer1 ComponentHeight: 0.4mm; Manufacturer1 Example: YAGEO PHYCOMP; Part Number: R0402_22K_1%_0.0625W_100PPM; Pin Count: 2; Power: 0.0625W; Sense: No; SMD: Yes; Status: Not Recommended; Tolerance: ±1%; Value: 22k; Component Kind: Standard; Component Type: Standard; Mounted: Yes; Socket: No; HelpURL: \\cern.ch\dfs\Applications\Altium\Datasheets\R0402_Phycomp_RC0402.pdf; Author: CERN DEM JLC; CreateDate: 03.12.2007; LatestRevisionDate: 17.10.2012
R103 = R0402_49R9_1%_0.0625W_100PPM: Resistor - 1%; Manufacturer: GENERIC; Manufacturer1 Part Number: 232270674999L or RC0402FR-0749R9L; Part Description: General Purpose Thick Film Chip Resistor; TC: ±100ppm/°C; PressFit: No; Case: 0402; Manufacturer Part Number: R0402_49R9_1%_0.0625W_100PPM; Manufacturer1 ComponentHeight: 0.4mm; Manufacturer1 Example: YAGEO PHYCOMP; Part Number: R0402_49R9_1%_0.0625W_100PPM; Pin Count: 2; Power: 0.0625W; Sense: No; SMD: Yes; Status: Not Recommended; Tolerance: ±1%; Value: 49R9; Component Kind: Standard; Component Type: Standard; Mounted: Yes; Socket: No; HelpURL: \\cern.ch\dfs\Applications\Altium\Datasheets\R0402_Phycomp_RC0402.pdf; Author: CERN DEM JLC; CreateDate: 24.10.2012; LatestRevisionDate: 24.10.2012
R107 R108 R127 = R0402_10K_1%_0.0625W_100PPM: Resistor - 1%; Manufacturer: GENERIC; Manufacturer1 Part Number: 232270671003L; Part Description: General Purpose Thick Film Chip Resistor; TC: ±100ppm/°C; PressFit: No; Case: 0402; Manufacturer Part Number: R0402_10K_1%_0.0625W_100PPM; Manufacturer1 ComponentHeight: 0.4mm; Manufacturer1 Example: YAGEO PHYCOMP; Part Number: R0402_10K_1%_0.0625W_100PPM; Pin Count: 2; Power: 0.0625W; Sense: No; SMD: Yes; Status: Not Recommended; Tolerance: ±1%; Value: 10k; Component Kind: Standard; Component Type: Standard; Mounted: Yes; Socket: No; HelpURL: \\cern.ch\dfs\Applications\Altium\Datasheets\R0402_Phycomp_RC0402.pdf; Author: CERN DEM JLC; CreateDate: 03.12.2007; LatestRevisionDate: 17.10.2012
R135 = R0603_51R_1%_0.1W_100PPM: Resistor - 1%; Part Description: General Purpose Thick Film Chip Resistor; Manufacturer: GENERIC; Manufacturer1 Part Number: NRC06F51R0TRF; Power: 0.1W; TC: ±100ppm/°C; PressFit: No; Part Number: R0603_51R_1%_0.1W_100PPM; Component Kind: Standard; Component Type: Standard; Pin Count: 2; Value: 51; Status: Preferred; Tolerance: ±1%; Manufacturer Part Number: R0603_51R_1%_0.1W_100PPM; Case: 0603; Mounted: Yes; Sense: No; Socket: No; SMD: Yes; Manufacturer1 Example: NIC COMPONENT; Manufacturer1 ComponentHeight: 0.55mm; HelpURL: \\cern.ch\dfs\Applications\Altium\Datasheets\R0603_NIC_NRC.pdf; Author: CERN DEM JLC; CreateDate: 03.12.2007; LatestRevisionDate: 13.03.2008
R136-R138 R141 = R0603_1K1_1%_0.1W_100PPM: Resistor - 1%; Part Description: General Purpose Thick Film Chip Resistor; Manufacturer: GENERIC; Manufacturer1 Part Number: NRC06F1101TRF; Power: 0.1W; TC: ±100ppm/°C; PressFit: No; Part Number: R0603_1K1_1%_0.1W_100PPM; Component Kind: Standard; Component Type: Standard; Pin Count: 2; Value: 1k1; Status: Preferred; Tolerance: ±1%; Manufacturer Part Number: R0603_1K1_1%_0.1W_100PPM; Case: 0603; Mounted: Yes; Sense: No; Socket: No; SMD: Yes; Manufacturer1 Example: NIC COMPONENT; Manufacturer1 ComponentHeight: 0.55mm; HelpURL: \\cern.ch\dfs\Applications\Altium\Datasheets\R0603_NIC_NRC.pdf; Author: CERN DEM JLC; CreateDate: 03.12.2007; LatestRevisionDate: 13.03.2008
R204 = R0603_49K9_0.1%_0.063W_10PPM: Resistor - 0.1%; Manufacturer: GENERIC; Manufacturer1 Part Number: RN73C1J49K9BTDF; Part Description: Thin Film Chip Resistor; Power: 0.063W; TC: ±10ppm; PressFit: No; Case: 0603; Manufacturer Part Number: R0603_49K9_0.1%_0.063W_10PPM; Manufacturer1 ComponentHeight: 0.5mm; Manufacturer1 Example: TYCO HOLSWORTHY; Part Number: R0603_49K9_0.1%_0.063W_10PPM; Pin Count: 2; Sense: No; SMD: Yes; Status: Not Recommended; Tolerance: ±0.1%; Value: 49k9; Component Kind: Standard; Component Type: Standard; Mounted: Yes; Socket: No; HelpURL: \\cern.ch\dfs\Applications\Altium\Datasheets\R0603_Tyco_RN73.pdf; Author: CERN DEM JLC; CreateDate: 03.12.2007; LatestRevisionDate: 13.03.2008
R206 = R0603_1K69_0.1%_0.063W_10PPM: Resistor - 0.1%; Manufacturer: GENERIC; Manufacturer1 Part Number: RN73C1J1K69BTDF; Part Description: Thin Film Chip Resistor; Power: 0.063W; TC: ±10ppm; PressFit: No; Case: 0603; Manufacturer Part Number: R0603_1K69_0.1%_0.063W_10PPM; Manufacturer1 ComponentHeight: 0.5mm; Manufacturer1 Example: TYCO HOLSWORTHY; Part Number: R0603_1K69_0.1%_0.063W_10PPM; Pin Count: 2; Sense: No; SMD: Yes; Status: Not Recommended; Tolerance: ±0.1%; Value: 1k69; Component Kind: Standard; Component Type: Standard; Mounted: Yes; Socket: No; HelpURL: \\cern.ch\dfs\Applications\Altium\Datasheets\R0603_Tyco_RN73.pdf; Author: CERN DEM JLC; CreateDate: 03.12.2007; LatestRevisionDate: 13.03.2008
R207 = R0603_3K09_0.1%_0.063W_10PPM: Resistor - 0.1%; Manufacturer: GENERIC; Manufacturer1 Part Number: RN73C1J3K09BTDF; Part Description: Thin Film Chip Resistor; Power: 0.063W; TC: ±10ppm; PressFit: No; Case: 0603; Manufacturer Part Number: R0603_3K09_0.1%_0.063W_10PPM; Manufacturer1 ComponentHeight: 0.5mm; Manufacturer1 Example: TYCO HOLSWORTHY; Part Number: R0603_3K09_0.1%_0.063W_10PPM; Pin Count: 2; Sense: No; SMD: Yes; Status: Not Recommended; Tolerance: ±0.1%; Value: 3k09; Component Kind: Standard; Component Type: Standard; Mounted: Yes; Socket: No; HelpURL: \\cern.ch\dfs\Applications\Altium\Datasheets\R0603_Tyco_RN73.pdf; Author: CERN DEM JLC; CreateDate: 03.12.2007; LatestRevisionDate: 13.03.2008
R208 = R0603_33K2_0.1%_0.063W_10PPM: Resistor - 0.1%; Manufacturer: GENERIC; Manufacturer1 Part Number: RN73C1J33K2BTDF; Part Description: Thin Film Chip Resistor; Power: 0.063W; TC: ±10ppm; PressFit: No; Case: 0603; Manufacturer Part Number: R0603_33K2_0.1%_0.063W_10PPM; Manufacturer1 ComponentHeight: 0.5mm; Manufacturer1 Example: TYCO HOLSWORTHY; Part Number: R0603_33K2_0.1%_0.063W_10PPM; Pin Count: 2; Sense: No; SMD: Yes; Status: Not Recommended; Tolerance: ±0.1%; Value: 33k2; Component Kind: Standard; Component Type: Standard; Mounted: Yes; Socket: No; HelpURL: \\cern.ch\dfs\Applications\Altium\Datasheets\R0603_Tyco_RN73.pdf; Author: CERN DEM JLC; CreateDate: 03.12.2007; LatestRevisionDate: 13.03.2008
SH1 = MSBOX_WURTH_36103305: Metal Screening Box 20 (4x5) Pins; Manufacturer: WURTH; Part Description: Shielding Cabinet SMD-Frame WE-SHC, Internal Dimensions 30 x 30mm; PressFit: No; Author: CERN DEM JLC; Component Kind: Standard; Component Type: Standard; ComponentHeight: 3.1mm; CreateDate: 02.07.2012; HelpURL: \\cern.ch\dfs\Applications\Altium\Datasheets\MSBOX_WURTH_36103305.pdf; LatestRevisionDate: 02.07.2012; Manufacturer Part Number: 36103305; Mounted: Yes; PackageDescription: Shielding Cabinet SMD-Frame WE-SHC, Internal Dimensions 30 x 30mm; Part Number: MSBOX_WURTH_36103305; Pin Count: 20; Sense: No; SMD: Yes; Socket: No; Status: None
T14-T16 = BSS138LT1G: N-CHANNEL MOSFET WITH DIODE; Manufacturer: ON SEMICONDUCTOR; Part Description: 50V 200mA N-Channel Enhancement Mode Field-Effect Transistor; Bonding: No; PressFit: No; Case: SOT23-3; ComponentHeight: 1.11mm; Device: BSS138LT1G; Manufacturer Part Number: BSS138LT1G; Mounted: Yes; PackageDescription: SOT23 3-Leads, Pitch 0.95mm - Body 1.4x3mm, IPC Medium Density; Part Number: BSS138LT1G; Pin Count: 3; Sense: No; SMD: Yes; Socket: No; Component Kind: Standard; Component Type: Standard; HelpURL: \\cern.ch\dfs\Applications\Altium\Datasheets\BSS138LT1G.pdf; Author: CERN DEM JLC; CreateDate: 23.03.2009; LatestRevisionDate: 23.03.2009
TP2-TP5 TP46 TP57 TP74 TP75 = SMD_PAD_1.27X1.27MM: Part Description: 1.27mm x 1.27mm PCB Copper Area (SMD Test Point); Mounted: No; ComponentHeight: 0mm; Family: Test Point; Part Number: SMD_PAD_1.27X1.27MM; Pin Count: 1; Sense: No; SMD: Yes; Socket: No; Status: None; Component Kind: Standard (No BOM); Component Type: Standard (No BOM); HelpURL: Undefined; Author: CERN DEM JLC; CreateDate: 12.01.2008; LatestRevisionDate: 12.01.2008; PackageDescription: 1.27mm x 1.27mm PCB Copper Area (SMD Test Point)